# Altium project PCB_Project1.PrjPCB
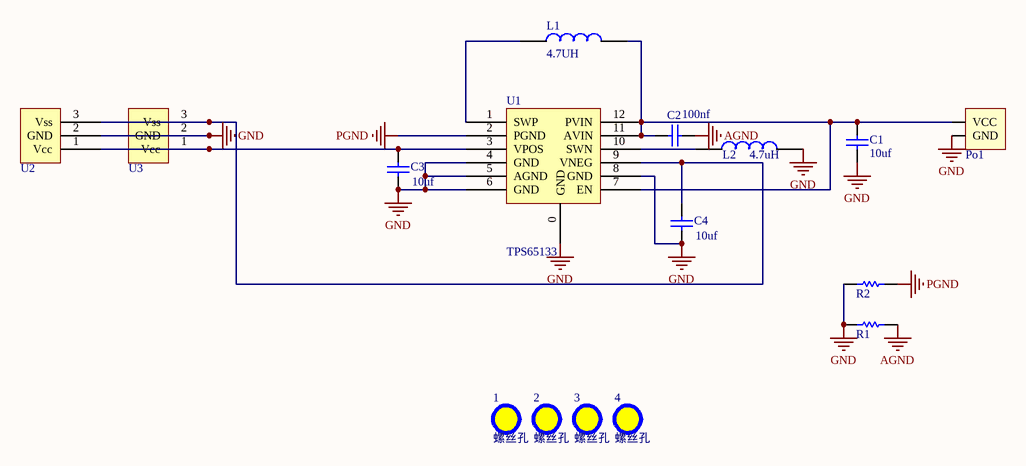
[diagram p0: Sheet1.SchDoc]
1 sheet, 16 parts. Net scope: global (net labels, ports and power ports of the same name join across sheets).
Board file: PCB1.PcbDoc

## Sheet Sheet1.SchDoc
size A4

### Parts
1  螺丝孔  [固定过孔]
2  螺丝孔  [固定过孔]
3  螺丝孔  [固定过孔]
4  螺丝孔  [固定过孔]
C1  值: 10uf  [0805]  (hidden comment: Cap1)
C2  值: 100nf  [0805]  (hidden comment: Cap1)
C3  值: 10uf  [0805]  (hidden comment: Cap1)
C4  值: 10uf  [0805]  (hidden comment: Cap1)
L1  4.7UH  [2520]
L2  4.7uH  [2520]
Po1  Power_2Port  [Power_S_2Port]  (value not drawn)
R1  RES  [0805]  (value not drawn)
R2  RES  [0805]  (value not drawn)
U1  TPS65133  [QFN-12 3X3]
U2  XH2.54-3p  [XH2.54-3p]  (value not drawn)
U3  XH2.54-3p  [XH2.54-3p]  (value not drawn)

### Nets
AGND: C2.1 R1.2
GND: C1.1 C3.1 C4.1 L2.2 Po1.2(GND) R1.1 R2.1 U1.0(GND) U1.4(GND) U1.5(AGND) U1.6(GND) U1.8(GND) U2.2(GND) U3.2(GND)
PGND: R2.2 U1.2(PGND)
NetC1_2: C1.2 C2.2 L1.2 Po1.1(VCC) U1.7(EN) U1.11(AVIN) U1.12(PVIN)
NetC3_2: C3.2 U1.3(VPOS) U2.1(Vcc) U3.1(Vcc)
NetC4_2: C4.2 U1.9(VNEG) U2.3(Vss) U3.3(Vss)
NetL1_1: L1.1 U1.1(SWP)
NetL2_1: L2.1 U1.10(SWN)

### Notes on the sheet
- (in symbol Cap) +

### Library data of the parts
L1 L2 = IND DFE252012C
R1 R2 = RES: 值: 1k